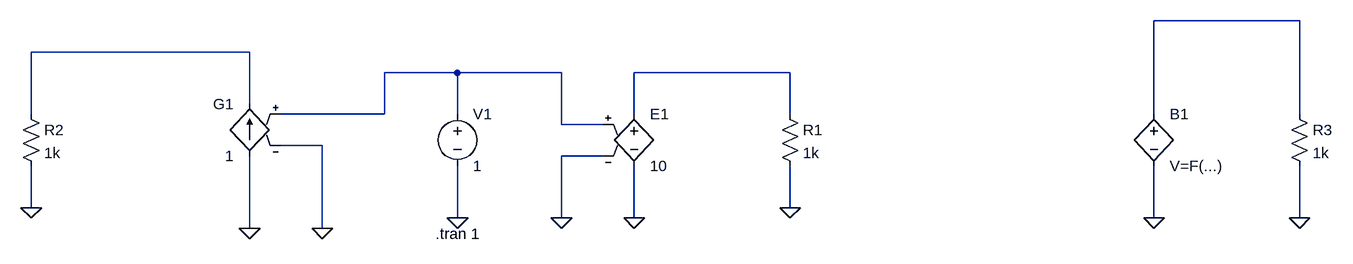
[diagram p0: schematic Draft ep7.asc]
Draft ep7.asc, the LTspice schematic file:
Version 4
SHEET 1 1288 680
WIRE 1232 -16 1008 -16
WIRE -384 32 -720 32
WIRE -64 64 -176 64
WIRE 96 64 -64 64
WIRE 448 64 208 64
WIRE -384 112 -384 32
WIRE -720 128 -720 32
WIRE -176 128 -176 64
WIRE -176 128 -336 128
WIRE -64 128 -64 64
WIRE 208 128 208 64
WIRE 448 128 448 64
WIRE 1008 128 1008 -16
WIRE 1232 128 1232 -16
WIRE 96 144 96 64
WIRE 160 144 96 144
WIRE -272 176 -336 176
WIRE 160 192 96 192
WIRE -720 272 -720 208
WIRE 448 272 448 208
WIRE -64 288 -64 208
WIRE 96 288 96 192
WIRE 208 288 208 208
WIRE 1008 288 1008 208
WIRE 1232 288 1232 208
WIRE -384 304 -384 192
WIRE -272 304 -272 176
FLAG -64 288 0
FLAG 96 288 0
FLAG 208 288 0
FLAG 448 272 0
FLAG -720 272 0
FLAG -384 304 0
FLAG -272 304 0
FLAG 1008 288 0
FLAG 1232 288 0
SYMBOL e 208 112 R0
SYMATTR InstName E1
SYMATTR Value 10
SYMBOL voltage -64 112 R0
WINDOW 123 0 0 Left 0
WINDOW 39 0 0 Left 0
SYMATTR InstName V1
SYMATTR Value 1
SYMBOL res 432 112 R0
SYMATTR InstName R1
SYMATTR Value 1k
SYMBOL res -736 112 R0
SYMATTR InstName R2
SYMATTR Value 1k
SYMBOL g -384 96 M0
SYMATTR InstName G1
SYMATTR Value 1
SYMBOL bv 1008 112 R0
SYMATTR InstName B1
SYMBOL res 1216 112 R0
SYMATTR InstName R3
SYMATTR Value 1k
TEXT -98 312 Left 2 !.tran 1

The netlist it stands for:
* Draft ep7.asc
E1 N004 0 N003 0 10
V1 N003 0 1
R1 N004 0 1k
R2 N002 0 1k
G1 0 N002 N003 0 1
B1 N001 0 V=F(...)
R3 N001 0 1k
.tran 1
.backanno
.end